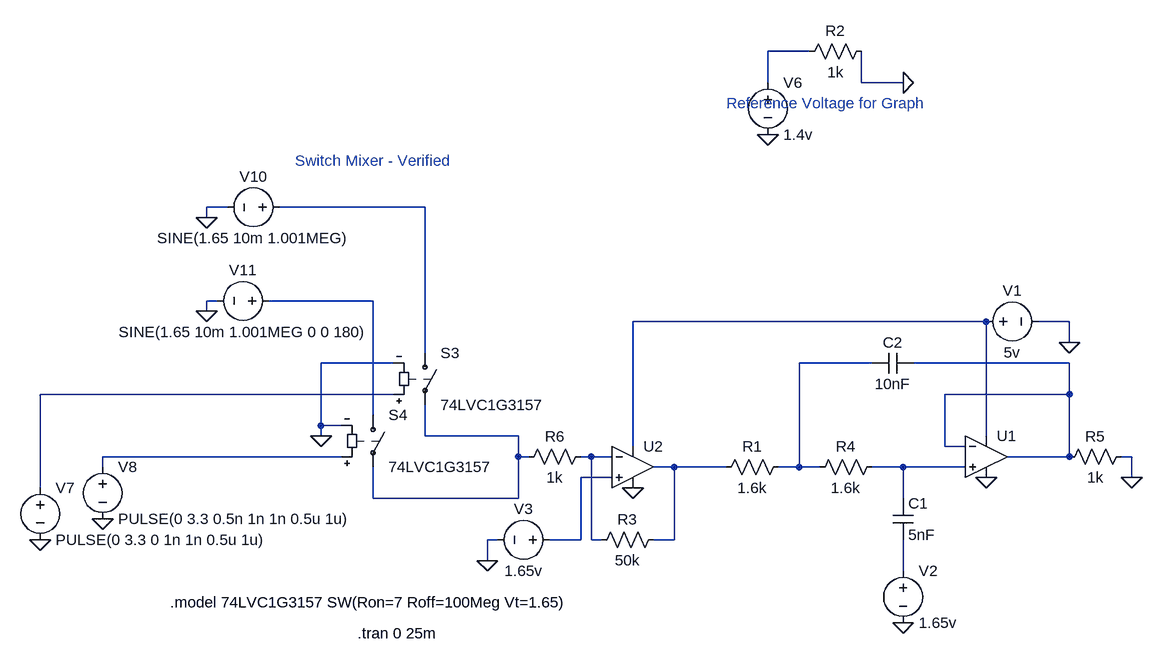
[diagram p0: schematic SDR-ERRORMixerAmpSim.asc]
SDR-ERRORMixerAmpSim.asc, the LTspice schematic file:
Version 4.1
SHEET 1 1428 1048
WIRE 912 48 848 48
WIRE 848 96 848 48
WIRE 992 96 992 48
WIRE 1056 96 992 96
WIRE 16 288 -16 288
WIRE 320 288 96 288
WIRE -16 304 -16 288
WIRE 0 432 -16 432
WIRE 240 432 80 432
WIRE -16 448 -16 432
WIRE 1184 464 640 464
WIRE 1312 464 1264 464
WIRE 1312 496 1312 464
WIRE 320 512 320 288
WIRE 272 528 160 528
WIRE 1008 528 896 528
WIRE 1312 528 1072 528
WIRE 272 576 -272 576
WIRE 1312 576 1312 528
WIRE 1312 576 1120 576
WIRE 240 608 240 432
WIRE 160 624 160 528
WIRE 192 624 160 624
WIRE 160 640 160 624
WIRE 320 640 320 592
WIRE 464 640 320 640
WIRE 1184 640 1184 464
WIRE 640 656 640 464
WIRE 1120 656 1120 576
WIRE 1152 656 1120 656
WIRE 192 672 -176 672
WIRE 464 672 464 640
WIRE 480 672 464 672
WIRE 576 672 560 672
WIRE 608 672 576 672
WIRE 1312 672 1312 576
WIRE 1312 672 1216 672
WIRE 1408 672 1392 672
WIRE -176 688 -176 672
WIRE 704 688 672 688
WIRE 784 688 704 688
WIRE 896 688 896 528
WIRE 896 688 864 688
WIRE 928 688 896 688
WIRE 1056 688 1008 688
WIRE 1152 688 1056 688
WIRE 608 704 560 704
WIRE 1408 704 1408 672
WIRE -272 720 -272 576
WIRE 240 736 240 688
WIRE 464 736 464 672
WIRE 464 736 240 736
WIRE 1056 736 1056 688
WIRE 432 800 416 800
WIRE 560 800 560 704
WIRE 560 800 512 800
WIRE 576 800 576 672
WIRE 592 800 576 800
WIRE 704 800 704 688
WIRE 704 800 672 800
WIRE 416 832 416 800
WIRE 1056 848 1056 800
FLAG 848 176 0
FLAG 1056 96 0
FLAG 160 640 0
FLAG -272 800 0
FLAG -176 768 0
FLAG -16 448 0
FLAG -16 304 0
FLAG 1184 704 0
FLAG 1408 704 0
FLAG 1312 496 0
FLAG 1056 928 0
FLAG 640 720 0
FLAG 416 832 0
SYMBOL voltage 848 80 R0
WINDOW 123 0 0 Left 0
WINDOW 39 0 0 Left 0
SYMATTR InstName V6
SYMATTR Value 1.4v
SYMBOL res 1008 32 R90
WINDOW 0 0 56 VBottom 2
WINDOW 3 32 56 VTop 2
SYMATTR InstName R2
SYMATTR Value 1k
SYMBOL voltage -272 704 R0
WINDOW 123 0 0 Left 0
WINDOW 39 0 0 Left 0
SYMATTR InstName V7
SYMATTR Value PULSE(0 3.3 0 1n 1n 0.5u 1u)
SYMBOL voltage -176 672 R0
WINDOW 123 0 0 Left 0
WINDOW 39 0 0 Left 0
SYMATTR InstName V8
SYMATTR Value PULSE(0 3.3 0.5n 1n 1n 0.5u 1u)
SYMBOL sw 320 496 R0
SYMATTR InstName S3
SYMATTR Value 74LVC1G3157
SYMBOL sw 240 592 R0
SYMATTR InstName S4
SYMATTR Value 74LVC1G3157
SYMBOL voltage 112 288 R90
WINDOW 0 -32 56 VBottom 2
WINDOW 3 32 56 VTop 2
WINDOW 123 0 0 Left 0
WINDOW 39 0 0 Left 0
SYMATTR InstName V10
SYMATTR Value SINE(1.65 10m 1.001MEG)
SYMBOL voltage 96 432 R90
WINDOW 0 -32 56 VBottom 2
WINDOW 3 32 56 VTop 2
WINDOW 123 0 0 Left 0
WINDOW 39 0 0 Left 0
SYMATTR InstName V11
SYMATTR Value SINE(1.65 10m 1.001MEG 0 0 180)
SYMBOL res 880 672 R90
WINDOW 0 0 56 VBottom 2
WINDOW 3 32 56 VTop 2
SYMATTR InstName R1
SYMATTR Value 1.6k
SYMBOL res 1024 672 R90
WINDOW 0 0 56 VBottom 2
WINDOW 3 32 56 VTop 2
SYMATTR InstName R4
SYMATTR Value 1.6k
SYMBOL cap 1040 736 R0
SYMATTR InstName C1
SYMATTR Value 5nF
SYMBOL cap 1072 512 R90
WINDOW 0 0 32 VBottom 2
WINDOW 3 32 32 VTop 2
SYMATTR InstName C2
SYMATTR Value 10nF
SYMBOL OpAmps\\UniversalOpAmp2 1184 672 R0
SYMATTR InstName U1
SYMBOL res 1408 656 R90
WINDOW 0 0 56 VBottom 2
WINDOW 3 32 56 VTop 2
SYMATTR InstName R5
SYMATTR Value 1k
SYMBOL voltage 1168 464 R270
WINDOW 0 32 56 VTop 2
WINDOW 3 -32 56 VBottom 2
WINDOW 123 0 0 Left 0
WINDOW 39 0 0 Left 0
SYMATTR InstName V1
SYMATTR Value 5v
SYMBOL voltage 1056 832 R0
WINDOW 123 0 0 Left 0
WINDOW 39 0 0 Left 0
SYMATTR InstName V2
SYMATTR Value 1.65v
SYMBOL OpAmps\\UniversalOpAmp2 640 688 R0
SYMATTR InstName U2
SYMBOL res 688 784 R90
WINDOW 0 0 56 VBottom 2
WINDOW 3 32 56 VTop 2
SYMATTR InstName R3
SYMATTR Value 50k
SYMBOL res 576 656 R90
WINDOW 0 0 56 VBottom 2
WINDOW 3 32 56 VTop 2
SYMATTR InstName R6
SYMATTR Value 1k
SYMBOL voltage 528 800 R90
WINDOW 0 -32 56 VBottom 2
WINDOW 3 32 56 VTop 2
WINDOW 123 0 0 Left 0
WINDOW 39 0 0 Left 0
SYMATTR InstName V3
SYMATTR Value 1.65v
TEXT -72 896 Left 2 !.model 74LVC1G3157 SW(Ron=7 Roff=100Meg Vt=1.65)
TEXT 120 216 Left 2 ;Switch Mixer - Verified
TEXT 784 128 Left 2 ;Reference Voltage for Graph
TEXT 216 944 Left 2 !.tran 0 25m

The netlist it stands for:
* SDR-ERRORMixerAmpSim.asc
V6 N001 0 1.4v
R2 0 N001 1k
V7 N007 0 PULSE(0 3.3 0 1n 1n 0.5u 1u)
V8 N009 0 PULSE(0 3.3 0.5n 1n 1n 0.5u 1u)
S3 N002 N008 N007 0 74LVC1G3157
S4 N003 N008 N009 0 74LVC1G3157
V10 N002 0 SINE(1.65 10m 1.001MEG)
V11 N003 0 SINE(1.65 10m 1.001MEG 0 0 180)
R1 N005 N011 1.6k
R4 N012 N005 1.6k
C1 N012 N014 5nF
C2 N006 N005 10nF
X§U1 N012 N006 N004 0 N006 level2 Avol=1Meg GBW=10Meg Slew=10Meg Ilimit=25m Rail=0 Vos=0 En=0 Enk=0 In=0 Ink=0 Rin=500Meg  ; pins In+ In- V+ V- OUT
R5 0 N006 1k
V1 N004 0 5v
V2 N014 0 1.65v
X§U2 N013 N010 N004 0 N011 level2 Avol=1Meg GBW=10Meg Slew=10Meg Ilimit=25m Rail=0 Vos=0 En=0 Enk=0 In=0 Ink=0 Rin=500Meg  ; pins In+ In- V+ V- OUT
R3 N011 N010 50k
R6 N010 N008 1k
V3 N013 0 1.65v
.model 74LVC1G3157 SW(Ron=7 Roff=100Meg Vt=1.65)
* Switch Mixer - Verified
* Reference Voltage for Graph
.tran 0 25m
.lib UniversalOpAmp2.lib
.backanno
.end